# Altium schematic sheet Power_VREF_P1V25.SchDoc
size A4; CompanyName: WEITI ISE; Address1: ul. Nowowiejska 15/19; Address2: 00-665 Warszawa; DocumentNumber: 11; SheetNumber: 11; SheetTotal: 11
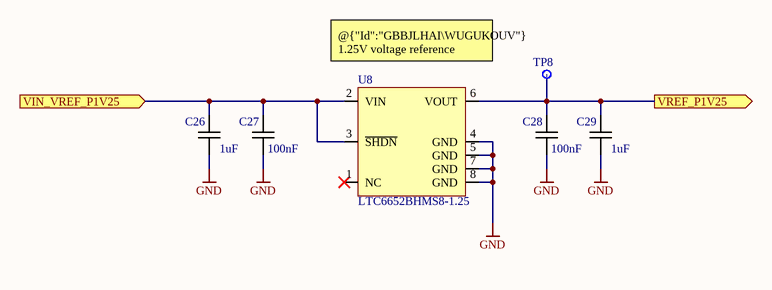
[diagram p0: Power_VREF_P1V25.SchDoc]

## Parts
C26  1uF  [CAPC0603X90N]
C27  100nF  [CAPC0603X90N]
C28  100nF  [CAPC0603X90N]
C29  1uF  [CAPC0603X90N]
TP8  TestPoint  [TESTPOINT_SMD_C1P27MM]  (value not drawn)  (no BOM)
U8  LTC6652BHMS8-1.25  [MSOP65P490X110-8N]

## Ports
VIN_VREF_P1V25 (in), VREF_P1V25 (out)

## Nets
GND: C26.2 C27.2 C28.2 C29.2 U8.4(GND) U8.5(GND) U8.7(GND) U8.8(GND)
VIN_VREF_P1V25: C26.1 C27.1 U8.2(VIN) U8.3(~{SHDN}) ; port VIN_VREF_P1V25
VREF_P1V25: C28.1 C29.1 TP8.1 U8.6(VOUT) ; port VREF_P1V25

Not connected (* = marked no-connect by the designer): U8 1(NC)*

## Notes on the sheet
- @{"Id":"GBBJLHAI\WUGUKOUV"} 1.25V voltage reference
- Project:
- Title
- File:
- Drawn by:
- Engineer:
- Checked by:
- Szymon Jedliński
- Sheet:
- Revision:
- Total Sheet:
- 1.0
- Variant:
- Approved by:
- Date:

## Library data of the parts
C26 C29 = CC0603_1UF_16V_10%_X7R: Non-polarised capacitor; Manufacturer Part Number: CL10B105KO8NNNC; DesignItemId: CC0603_1UF_16V_10%_X7R; HelpURL: https://www.mouser.pl/datasheet/2/585/MLCC-1837944.pdf; Height: 0.8mm; SMD: Yes; Value: 1uF
C27 C28 = CC0603_100NF_16V_10%_X7R: Non-polarised capacitor; Manufacturer Part Number: VJ0603Y104KXJCW1BC; DesignItemId: CC0603_100NF_16V_10%_X7R; HelpURL: https://www.vishay.com/docs/28548/vjw1bcbascomseries.pdf; Height: 0.8mm; SMD: Yes; Value: 100nF
TP8 = TESTPOINT_SMD_C1P27MM: 1.27mm diameter SMD Test Point Area; DesignItemId: TESTPOINT_SMD_C1P27MM; Family: TestPoint; Part Description: 1.27mm diameter SMD Test Point Area
U8 = LTC6652BHMS8-1.25: Precision Low Drift Low Noise Buffered Reference; Manufacturer Part Number: LTC6652BHMS8-1.25#PBF; Manufacturer 1 Component Height: 1.1mm; DesignItemId: LTC6652BHMS8-1.25; Device: LTC6652BHMS8-1.25; HelpURL: https://www.analog.com/media/en/technical-documentation/data-sheets/6652fg.pdf; SMD: Yes